# EAGLE design esp-lock (EAGLE 7.6.0)
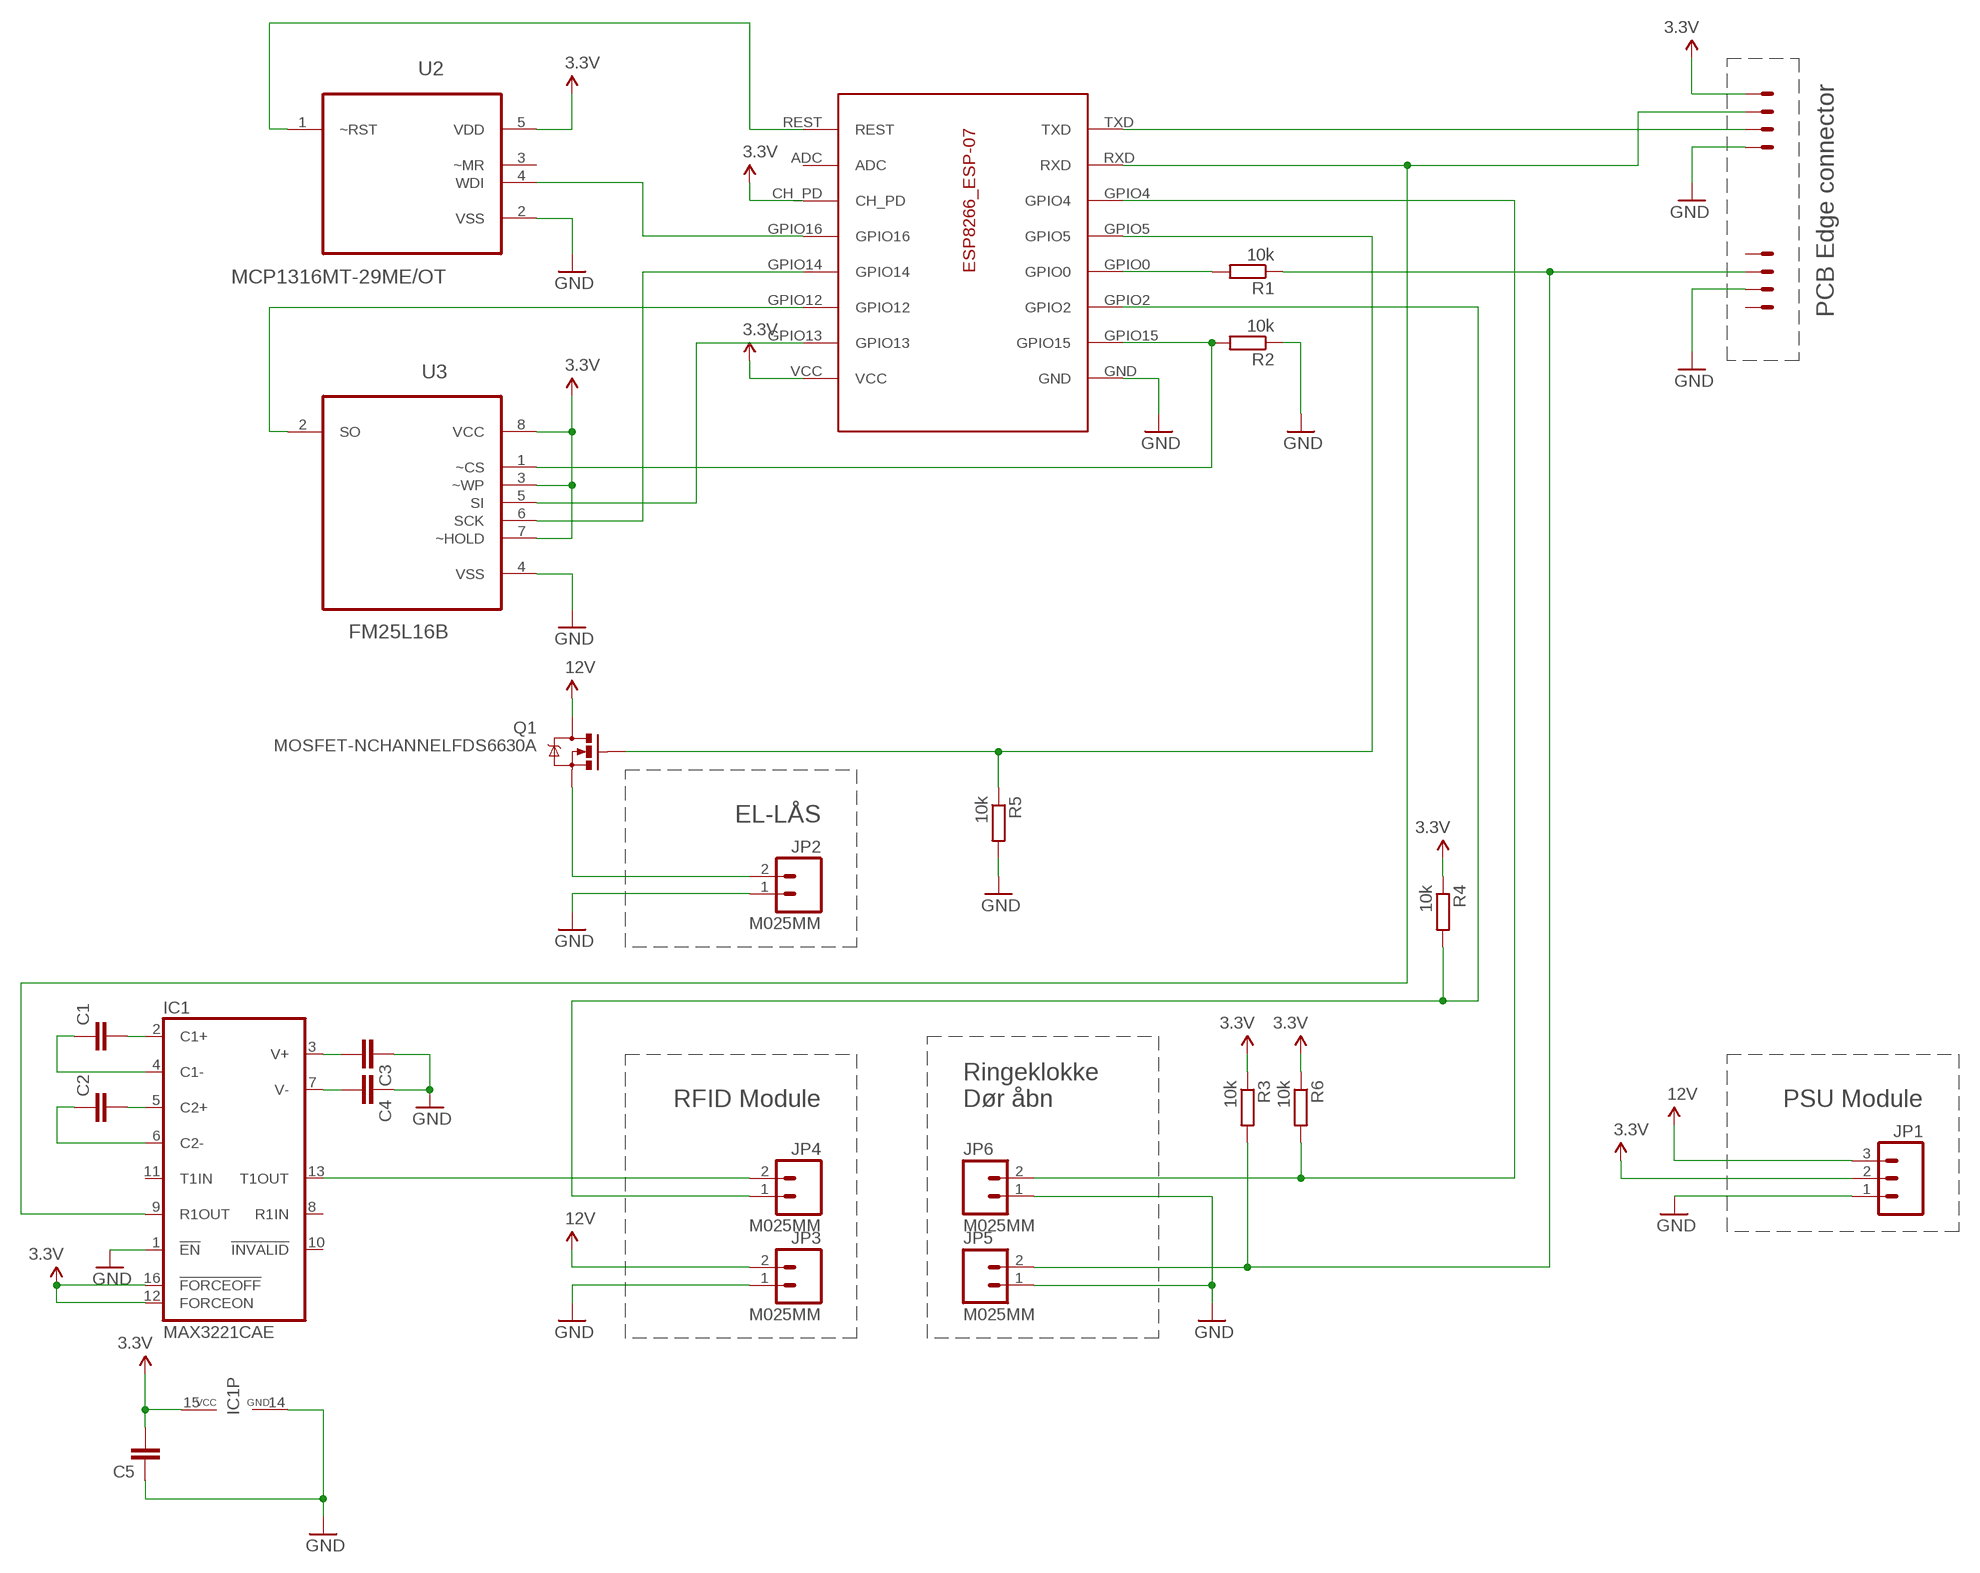
[diagram p0: schematic, sheet 1]

## Parts
C1  CAP0402-CAP  [0402-CAP]
C2  CAP0402-CAP  [0402-CAP]
C3  CAP0402-CAP  [0402-CAP]
C4  CAP0402-CAP  [0402-CAP]
C5  CAP0402-CAP  [0402-CAP]
ESP8266_ESP-07  ESP8266-07  [ESP-07]
IC1  MAX3221CAE  [SSOP16]
JP1  M03-SCREW-5MM  [SCREWTERMINAL-5MM-3]
JP2  M025MM  [SCREWTERMINAL-5MM-2]
JP3  M025MM  [SCREWTERMINAL-5MM-2]
JP4  M025MM  [SCREWTERMINAL-5MM-2]
JP5  M025MM  [SCREWTERMINAL-5MM-2]
JP6  M025MM  [SCREWTERMINAL-5MM-2]
Q1  MOSFET-NCHANNELFDS6630A  [SO08]
R1  10k  R-EU_R0805  [R0805]
R2  10k  R-EU_R0805  [R0805]
R3  10k  R-EU_R0805  [R0805]
R4  10k  R-EU_R0805  [R0805]
R5  10k  R-EU_R0805  [R0805]
R6  10k  R-EU_R0805  [R0805]
U2  MCP1316MT-29ME/OT  MCP1316T-29LE/OT  [SOT95P270X145-5N]
U3  FM25L16B  25AA020A-I/SN  [SOIC127P600X175-8N]
U$1  CON-PCB-SLOT-0.05MINIMAL  [CONN_SLOT_MINIMAL]

## Nets
3.3V: C5.2 ESP8266_ESP-07.CH_PD ESP8266_ESP-07.VCC IC1.12(FORCEON) IC1.15(VCC) IC1.16(!FORCEOFF) JP1.2 R3.1 R4.1 R6.1 U2.5(VDD) U3.3(~WP) U3.7(~HOLD) U3.8(VCC) U$1.4
5V: JP1.3 JP3.2 Q1.5(D) Q1.6(D) Q1.7(D) Q1.8(D) ; supply symbol labelled 12V
GND: C3.1 C4.1 C5.1 ESP8266_ESP-07.GND IC1.1(!EN) IC1.14(GND) JP1.1 JP2.1 JP3.1 JP5.1 JP6.1 R2.1 R5.2 U2.2(VSS) U3.4(VSS) U$1.1 U$1.7
N$1: ESP8266_ESP-07.TXD U$1.2
N$2: ESP8266_ESP-07.RXD IC1.9(R1OUT) U$1.3
N$3: JP2.2 Q1.1(S) Q1.2(S) Q1.3(S)
N$4: ESP8266_ESP-07.GPIO0 R1.2
N$5: JP5.2 R1.1 R3.2 U$1.6
N$6: ESP8266_ESP-07.GPIO2 JP4.1 R4.2
N$7: ESP8266_ESP-07.GPIO15 R2.2 U3.1(~CS)
N$8: ESP8266_ESP-07.REST U2.1(~RST)
N$9: ESP8266_ESP-07.GPIO16 U2.4(WDI)
N$10: ESP8266_ESP-07.GPIO12 U3.2(SO)
N$11: ESP8266_ESP-07.GPIO5 Q1.4(G) R5.1
N$12: ESP8266_ESP-07.GPIO13 U3.5(SI)
N$13: ESP8266_ESP-07.GPIO14 U3.6(SCK)
N$14: ESP8266_ESP-07.GPIO4 JP6.2 R6.2
N$15: IC1.13(T1OUT) JP4.2
N$16: C4.2 IC1.7(V-)
N$17: C3.2 IC1.3(V+)
N$18: C1.2 IC1.2(C1+)
N$19: C2.2 IC1.5(C2+)
N$20: C1.1 IC1.4(C1-)
N$21: C2.1 IC1.6(C2-)
Unconnected: ESP8266_ESP-07.ADC IC1.8(R1IN) IC1.10(!INVALID) IC1.11(T1IN) U2.3(~MR) U$1.5 U$1.8

## Notes on the sheet
- PCB Edge connector
- EL-LÅS
- RFID Module
- Ringeklokke
  Dør åbn
- PSU Module

## Library data of the parts
C1-C5 = SparkFun-Passives:CAP: Capacitor Standard 0603 ceramic capacitor, and 0.1" leaded capacitor.
ESP8266_ESP-07 = lio:ESP8266
IC1 = maxim:MAX3221*: RS-232 Transceivers with AutoShutdown 1µA Supply-Current, True +3V to +5.5V http://dbserv.maxim-ic.com/; MF: MAXIM; MPN: MAX3221CAE+; OC_FARNELL: 9724508; OC_NEWARK: 53K7474
JP1 = SparkFun-Connectors:M03: Header 3 Standard 3-pin 0.1" header. Use with straight break away headers (SKU : PRT-00116), right angle break away headers (PRT-00553), swiss pins (PRT-00743), machine pins (PRT-00117), and female headers (PRT-00115). Molex polarized connector foot print use with SKU : PRT-08232 with associated crimp pins and housings.
JP2-JP6 = SparkFun-Connectors:M02: Standard 2-pin 0.1" header. Use with - straight break away headers ( PRT-00116) - right angle break away headers (PRT-00553) - swiss pins (PRT-00743) - machine pins (PRT-00117) - female headers (PRT-00115) Molex polarized connector foot print use with: PRT-08233 with associated crimp pins and housings. 2.54_SCREWTERM for use with PRT-10571. 3.5mm Screw Terminal footprints for PRT-08084 5mm Screw Terminal footprints for use with PRT-08433
Q1 = SparkFun-DiscreteSemi:MOSFET-NCHANNEL: Common NMOSFET Parts MFG P/N Store ID Prod ID FDD8780 TRANS-09984 SI7820DN TRANS-11055 FDS6630A IC-08089 2N7002PW TRANS-11151 FQP30N06L COM-10213 TRANS-10060 BSS123LT1G TRANS-08345 BSS138 TRANS-00830 BS170 2N7000; PROD_ID: IC-08089
R1-R6 = rcl:R-EU_: RESISTOR, European symbol
U2 = Microchip_By_element14_Batch_1:MCP1316T-29LE/OT: Voltage Supervisor; MPN: MCP1316T-29LE/OT; OC_FARNELL: 1332071; OC_NEWARK: 34M7402; PACKAGE: SOT-5; SUPPLIER: Microchip
U3 = Microchip_By_element14_Batch_1:25AA020A-I/SN: 2K SPI Bus Serial EEPROM; MPN: 25AA020A-I/SN; OC_FARNELL: 1331343; OC_NEWARK: 72J3627; PACKAGE: SOIC-8; SUPPLIER: MICROCHIP
U$1 = con-pcb-slot:CON-PCB-SLOT-0.05: PCB slot (edge) connector with 0.05" pitch (based on conventional PCI)

## Board
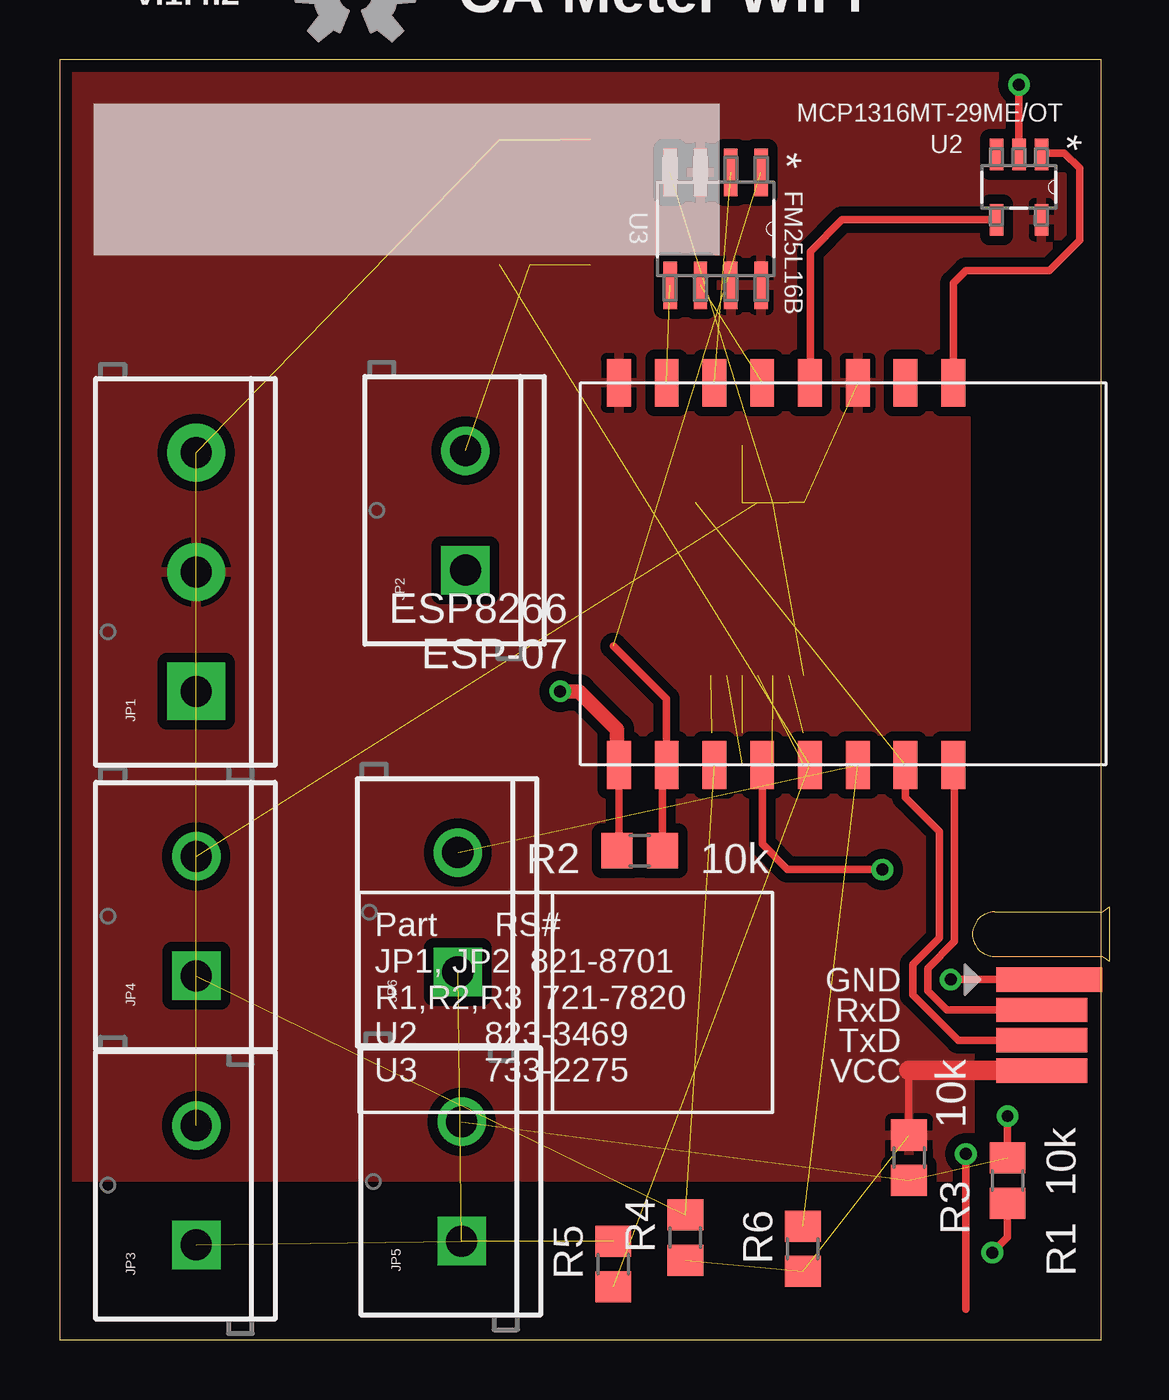
[diagram p1: board, top side]
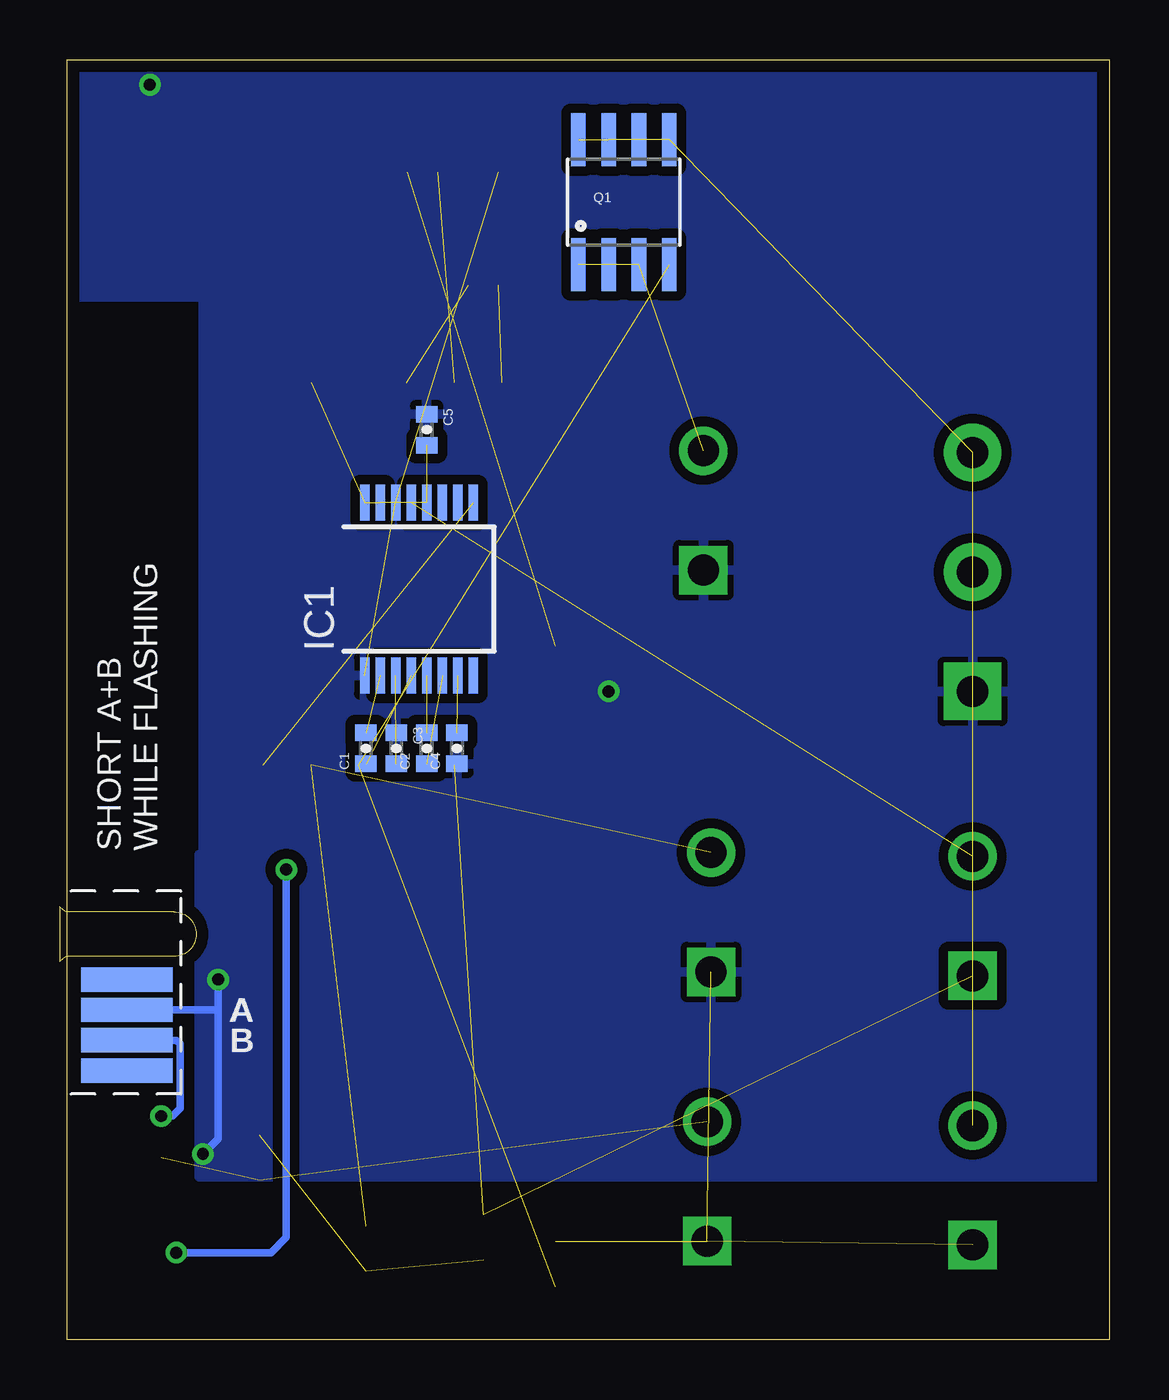
[diagram p2: board, bottom side, seen from below]

Size 43.62 x 53.59 mm. Coordinates in mm from the lower left corner, seen from the top.
Outline: 0,0 43.62,0 43.62,53.59 0,53.59 0,0
Copper layers (1*16): Top 0.035mm / dielectric 1.5mm / Bottom 0.035mm
Design rules "default *": minimum track width 10mil, minimum drill 24mil, track to track 8mil, track to pad 8mil, pad to pad 8mil, via to via 8mil, smd to smd 8mil, copper to edge 20mil, drill to drill 20mil, minimum pad ring 10mil, minimum via ring 8mil, stop-mask expansion 4mil, vias tented up to drill 0mil, thermal gap 10mil

### Footprints (pad centres in the part's own frame; a part is rotated, then mirrored left to right if it is on the bottom)
0402-CAP = smd 0.7 x 0.9: 1 -0.65,0; 2 0.65,0
ESP-07 = smd 1 x 2: ADC -1.6,-8; CH_PD 0.4,-8; GND 10.4,8; GPIO0 4.4,8; GPIO2 6.4,8; GPIO4 0.4,8; GPIO5 2.4,8; GPIO12 6.4,-8; GPIO13 8.4,-8; GPIO14 4.4,-8; GPIO15 8.4,8; GPIO16 2.4,-8; REST -3.6,-8; RXD -1.6,8; TXD -3.6,8; VCC 10.4,-8
SSOP16 = smd 0.4 x 1.5: 1 -2.275,-3.625; 2 -1.625,-3.625; 3 -0.975,-3.625; 4 -0.325,-3.625; 5 0.325,-3.625; 6 0.975,-3.625; 7 1.625,-3.625; 8 2.275,-3.625; 9 2.275,3.625; 10 1.625,3.625; 11 0.975,3.625; 12 0.325,3.625; 13 -0.325,3.625; 14 -0.975,3.625; 15 -1.625,3.625; 16 -2.275,3.625
SCREWTERMINAL-5MM-3 = drill 1.3 pad 2.413 square: 1 0,0 | drill 1.3 pad 2.413: 2 5,0; 3 10,0
SCREWTERMINAL-5MM-2 = drill 1.3 pad 2.032 square: 1 0,0 | drill 1.3 pad 2.032: 2 5,0
SO08 = smd 0.61 x 2.21: 1 -1.905,-2.616; 2 -0.635,-2.616; 3 0.635,-2.616; 4 1.905,-2.616; 5 1.905,2.616; 6 0.635,2.616; 7 -0.635,2.616; 8 -1.905,2.616
R0805 = smd 1.3 x 1.5: 1 -0.95,0; 2 0.95,0
SOT95P270X145-5N = smd 1.321 x 0.559: 1 -1.372,0.94; 2 -1.372,0; 3 -1.372,-0.94; 4 1.372,-0.94; 5 1.372,0.94
SOIC127P600X175-8N = smd 1.981 x 0.559: 1 -2.362,1.905; 2 -2.362,0.635; 3 -2.362,-0.635; 4 -2.362,-1.905; 5 2.362,-1.905; 6 2.362,-0.635; 7 2.362,0.635; 8 2.362,1.905
CONN_SLOT_MINIMAL = smd 1.016 x 4.445: 1 1.905,-0.043 | smd 1.016 x 3.81: 2 0.635,0.275; 3 -0.635,0.275; 4 -1.905,0.275 | smd 1.016 x 3.81 bottom: 5 -1.905,0.275; 6 -0.635,0.275; 7 0.635,0.275; 8 1.905,0.275

### Placement (x,y rotation side)
C1  31.11,24.77 90 bottom
C2  28.57,24.77 90 bottom
C3  29.84,24.77 270 bottom
C4  27.3,24.77 90 bottom
C5  28.57,38.1 270 bottom
ESP8266_ESP-07  33.81,32.07 180 top
IC1  28.89,31.43 0 bottom
JP1  5.71,27.15 90 top
JP2  16.99,32.23 90 top
JP3  5.71,3.97 90 top
JP4  5.71,15.24 90 top
JP5  16.83,4.13 90 top
JP6  16.67,15.4 90 top
Q1  20.32,47.62 0 bottom
R1  39.69,6.67 270 top
R2  24.29,20.48 0 top
R3  35.56,7.62 270 top
R4  26.19,4.29 90 top
R5  23.18,3.17 90 top
R6  31.11,3.81 90 top
U2  40.16,48.26 270 top
U3  27.46,46.51 270 top
U$1  41.4,13.18 90 top
U$2  [OSHW-LOGO-M]  12.38,56.36 0 top

### Tracks (layer width: path | path; a pad name or v marks a point on that pad's centre or on a via)
3.3V  (6 unrouted)
  Top 0.305: 35.56,11.27 R3.1
  Top 0.813: 35.56,11.27 U$1.4
  pour Top (isolate 0.406): 0.48,6.83 38.1,6.83 38.1,20.32 37.94,20.32 37.94,43.66 43.66,43.66 43.66,53.34 0.48,53.34
5V  (5 unrouted)
GND  (via drill 0.5)  (5 unrouted)
  Top 0.305: U$1.1 v37.31,15.08 | 37.94,1.27 v37.94,7.78 | ESP8266_ESP-07.GND 23.41,20.55 R2.1 | U2.2 v40.16,52.55
  Top 0.61: 23.34,24.14 23.34,25.56 21.75,27.15 v20.95,27.15
  Top 0.813: 23.34,24.14 ESP8266_ESP-07.GND
  Bottom 0.305: U$1.7 37.31,13.81 | v37.31,15.08 37.31,8.41 v37.94,7.78
  pour Bottom (isolate 0.406): 0.48,6.83 38.1,6.83 38.1,20.32 37.94,20.32 37.94,43.66 43.66,43.66 43.66,53.34 0.48,53.34
N$1
  Top 0.305: ESP8266_ESP-07.TXD 37.47,24.02 37.47,16.67 36.35,15.56 36.35,14.61 37.15,13.81 U$1.2
N$2  (1 unrouted)
  Top 0.305: ESP8266_ESP-07.RXD 35.4,24.05 35.4,22.7 36.83,21.27 36.83,16.83 35.72,15.72 35.72,14.45 37.62,12.54 U$1.3
N$3  (3 unrouted)
N$4  (via drill 0.5)
  Top 0.305: 29.37,24.02 ESP8266_ESP-07.GPIO0 29.41,20.75 30.48,19.68 v34.45,19.68 | R1.2 39.69,4.29 v39.05,3.65
  Bottom 0.305: v34.45,19.68 34.45,4.29 35.08,3.65 v39.05,3.65
N$5  (via drill 0.5)  (2 unrouted)
  Top 0.305: v39.69,9.37 R1.1
  Bottom 0.305: U$1.6 39.05,12.54 38.89,12.38 38.89,9.68 39.21,9.37 v39.69,9.37
N$6  (2 unrouted)
N$7  (1 unrouted)
  Top 0.305: R2.2 25.24,23.89 ESP8266_ESP-07.GPIO15 25.4,26.83 23.18,29.05
N$8
  Top 0.305: ESP8266_ESP-07.REST 37.41,44.24 37.94,44.77 41.43,44.77 42.7,46.04 42.7,49.05 42.07,49.69 41.16,49.69 U2.1
N$9
  Top 0.305: U2.4 32.76,46.89 31.43,45.56 31.43,40.09 ESP8266_ESP-07.GPIO16
N$10  (1 unrouted)
N$11  (2 unrouted)
N$12  (1 unrouted)
N$13  (1 unrouted)
N$14  (2 unrouted)
N$15  (1 unrouted)
N$16  (1 unrouted)
N$17  (1 unrouted)
N$18  (1 unrouted)
N$19  (1 unrouted)
N$20  (1 unrouted)
N$21  (1 unrouted)

### Text on the board
tNames: v.1.4.2 | CA Meter WiFi | ESP8266 / ESP-07 | GND | RxD | TxD | Part RS# / JP1, JP2 821-8701 / R1,R2,R3 721-7820 / U2 823-3469 / U3 733-2275 | VCC
bNames: github.com / /nabovarme/electricity-meter-wifi | SHORT A+B / WHILE FLASHING | A | A | B